# Altium schematic sheet Description.SchDoc
size B
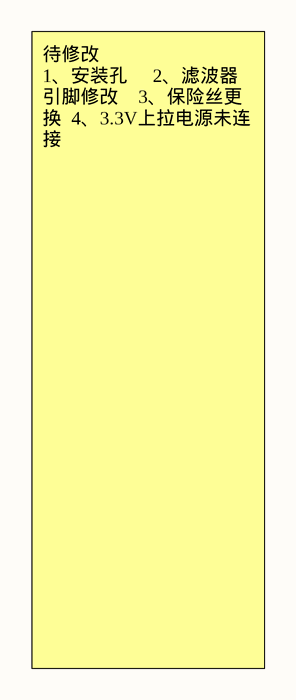
[diagram p0: Description.SchDoc]

## Notes on the sheet
- 待修改                                               1、安装孔     2、滤波器引脚修改    3、保险丝更换  4、3.3V上拉电源未连接